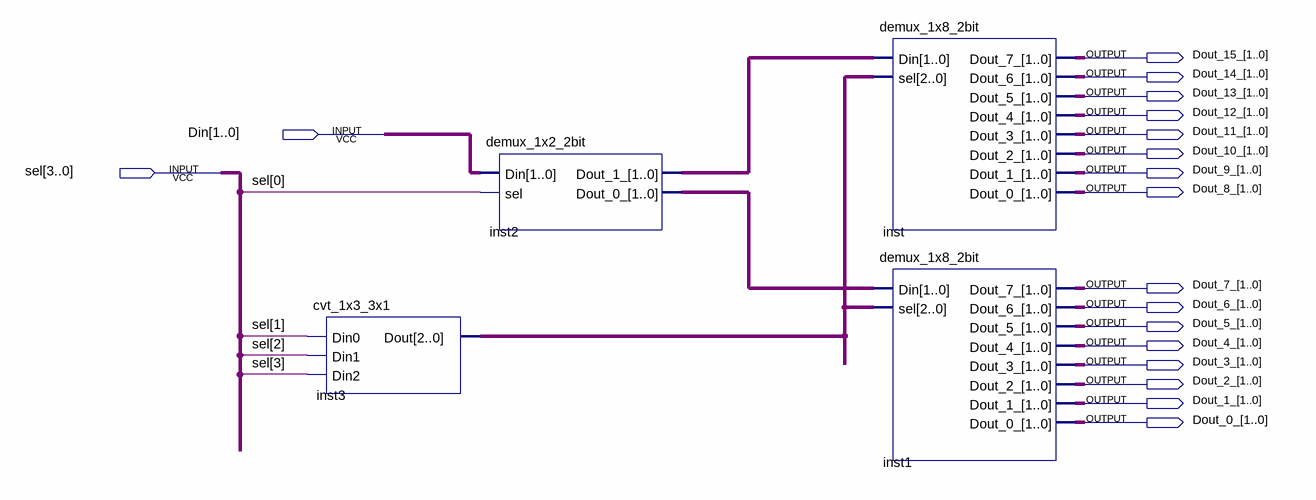
[diagram p0: schematic sheet]
// Quartus schematic demux_1x16_2bit.bdf as structural Verilog: 4 symbols, 18 pins
module demux_1x16_2bit (
  input  [1:0] Din,
  input  [3:0] sel,
  output [1:0] Dout_15_,
  output [1:0] Dout_14_,
  output [1:0] Dout_13_,
  output [1:0] Dout_12_,
  output [1:0] Dout_11_,
  output [1:0] Dout_10_,
  output [1:0] Dout_9_,
  output [1:0] Dout_8_,
  output [1:0] Dout_7_,
  output [1:0] Dout_6_,
  output [1:0] Dout_5_,
  output [1:0] Dout_4_,
  output [1:0] Dout_3_,
  output [1:0] Dout_2_,
  output [1:0] Dout_1_,
  output [1:0] Dout_0_
);

  wire [1:0] inst2_dout_0_, inst2_dout_1_;
  wire [2:0] inst3_dout;

  cvt_1x3_3x1 inst3 (.Din0(sel[1]), .Din1(sel[2]), .Din2(sel[3]), .Dout(inst3_dout));
  demux_1x2_2bit inst2 (.Din(Din), .sel(sel[0]), .Dout_1_(inst2_dout_1_), .Dout_0_(inst2_dout_0_));
  demux_1x8_2bit inst (
    .Din(inst2_dout_1_), .sel(inst3_dout), .Dout_7_(Dout_15_), .Dout_6_(Dout_14_), .Dout_5_(Dout_13_),
    .Dout_4_(Dout_12_), .Dout_3_(Dout_11_), .Dout_2_(Dout_10_), .Dout_1_(Dout_9_), .Dout_0_(Dout_8_));
  demux_1x8_2bit inst1 (
    .Din(inst2_dout_0_), .sel(inst3_dout), .Dout_7_(Dout_7_), .Dout_6_(Dout_6_), .Dout_5_(Dout_5_),
    .Dout_4_(Dout_4_), .Dout_3_(Dout_3_), .Dout_2_(Dout_2_), .Dout_1_(Dout_1_), .Dout_0_(Dout_0_));
endmodule
